# EAGLE design Yaesu to CIV_FET (EAGLE 9.6.2)
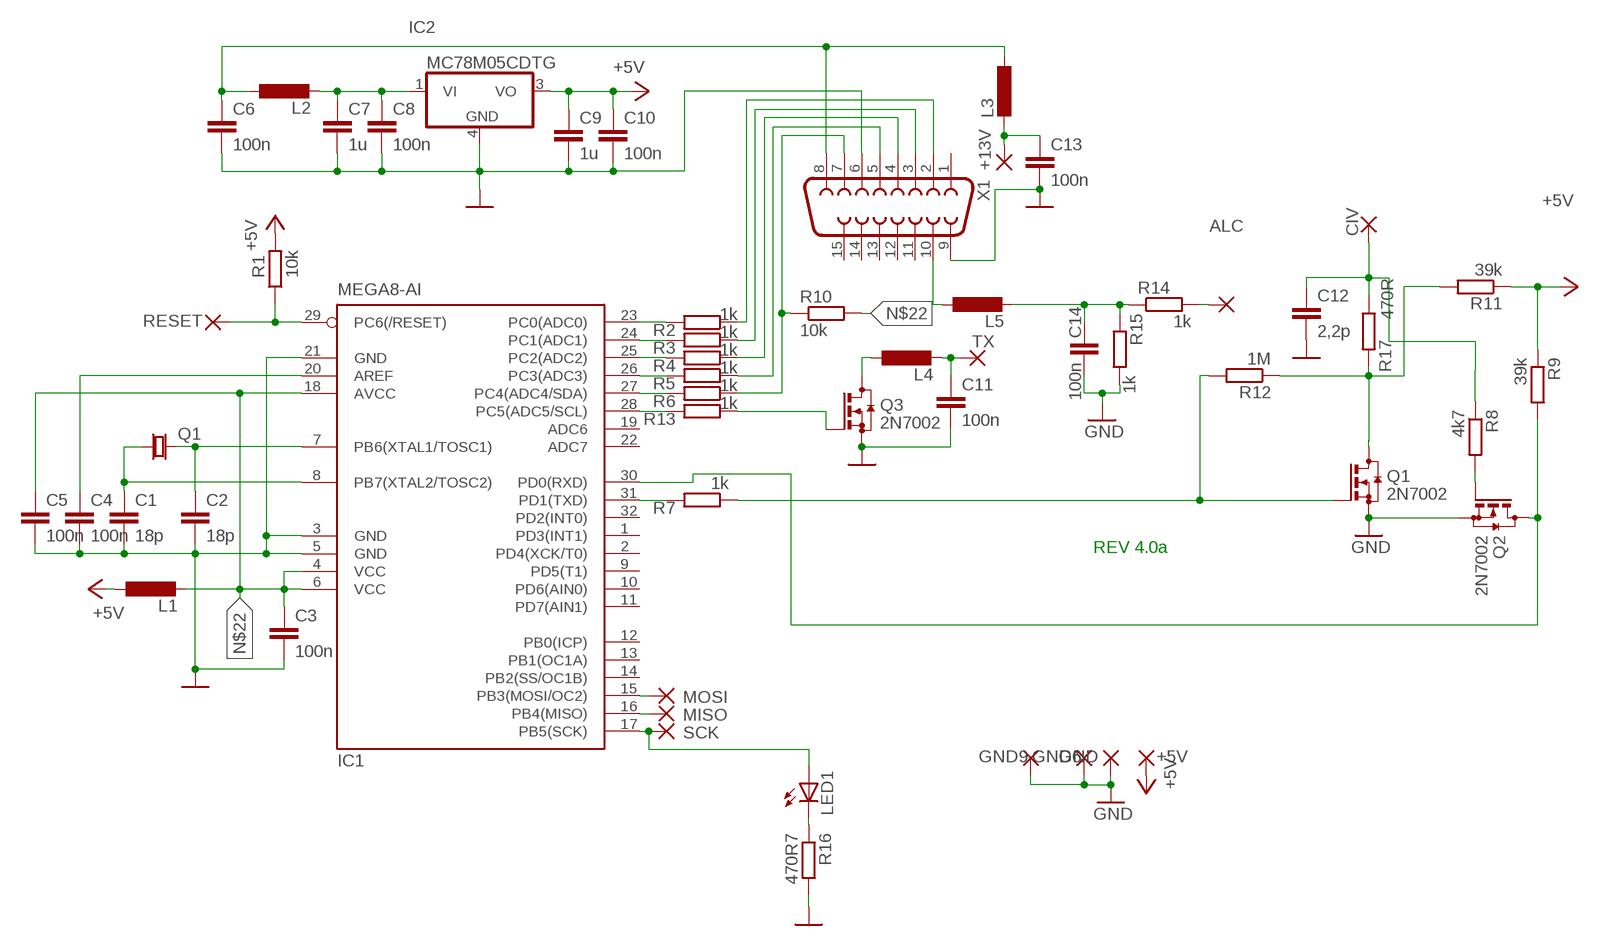
[diagram p0: schematic, sheet 1]

## Parts
+5V  SMD2  [SMD1,27-2,54]
+13V  SMD2  [SMD1,27-2,54]
ALC  SMD2  [SMD1,27-2,54]
C1  18p  C-EUC0603K  [C0603K]
C2  18p  C-EUC0603K  [C0603K]
C3  100n  C-EUC0603K  [C0603K]
C4  100n  C-EUC0603K  [C0603K]
C5  100n  C-EUC0603K  [C0603K]
C6  100n  C-EUC0603K  [C0603K]
C7  1u  C-EUC0805K  [C0805K]
C8  100n  C-EUC0603K  [C0603K]
C9  1u  C-EUC0805K  [C0805K]
C10  100n  C-EUC0603K  [C0603K]
C11  100n  C-EUC0603K  [C0603K]
C12  2,2p  C-EUC0603K  [C0603K]
C13  100n  C-EUC0603K  [C0603K]
C14  100n  C-EUC0603K  [C0603K]
CIV  SMD2  [SMD1,27-2,54]
GND  SMD2  [SMD1,27-2,54]
GND6  SMD2  [SMD1,27-2,54]
GND9  SMD2  [SMD1,27-2,54]
IC1  MEGA8-AI  [TQFP32-08]
IC2  MC78M05CDTG  [DPACK_3]
L1  L-EUL2012C  [L2012C]
L2  L-EUL1812  [L1812]
L3  L-EUL1812  [L1812]
L4  L-EUL2012C  [L2012C]
L5  L-EUL2012C  [L2012C]
LED1  LEDCHIP-LED0603  [CHIP-LED0603]
MISO  SMD2  [SMD1,27-2,54]
MOSI  SMD2  [SMD1,27-2,54]
Q1  2N7002  BSS123  [SOT23]
Q2  2N7002  BSS123  [SOT23]
Q3  2N7002  BSS123  [SOT23]
R1  10k  R-EU_R0603  [R0603]
R2  1k  R-EU_R0603  [R0603]
R3  1k  R-EU_R0603  [R0603]
R4  1k  R-EU_R0603  [R0603]
R5  1k  R-EU_R0603  [R0603]
R6  1k  R-EU_R0603  [R0603]
R7  1k  R-EU_R0603  [R0603]
R8  4k7  R-EU_R0603  [R0603]
R9  39k  R-EU_R0603  [R0603]
R10  10k  R-EU_R0603  [R0603]
R11  39k  R-EU_R0603  [R0603]
R12  1M  R-EU_R0603  [R0603]
R13  1k  R-EU_R0603  [R0603]
R14  1k  R-EU_R0603  [R0603]
R15  1k  R-EU_R0603  [R0603]
R16  470R7  R-EU_R0603  [R0603]
R17  470R  R-EU_R0603  [R0603]
RESET  SMD2  [SMD1,27-2,54]
SCK  SMD2  [SMD1,27-2,54]
TX  SMD2  [SMD1,27-2,54]
X1  F15D  [F15D]

## Nets
+5V: +5V.1(P) C9.1 C10.1 IC2.3(VO) L1.1 R1.2 R9.1 R11.1
+13V: C6.1 L2.1 L3.1 X1.8
GND: C1.2 C2.2 C3.2 C4.2 C5.2 C6.2 C7.2 C8.2 C9.2 C10.2 C11.2 C12.2 C13.2 C14.2 GND6.1(P) GND9.1(P) GND.1(P) IC1.3(GND) IC1.5(GND) IC1.21(GND) IC2.4(GND) Q1.2(S) Q2.2(S) Q3.2(S) R15.2 R16.2 X1.6 X1.9
N$1: C2.1 IC1.7(PB6(XTAL1/TOSC1))
N$2: C1.1 IC1.8(PB7(XTAL2/TOSC2))
N$3: IC1.29(PC6(/RESET)) R1.1 RESET.1(P)
N$4: Q1.3(D)
N$5: IC1.23(PC0(ADC0)) R2.2
N$7: IC1.31(PD1(TXD)) R7.2
N$8: C4.1 IC1.20(AREF)
N$9: IC1.24(PC1(ADC1)) R3.2
N$10: IC1.25(PC2(ADC2)) R4.2
N$11: IC1.26(PC3(ADC3)) R5.2
N$12: R2.1 X1.2
N$13: R3.1 X1.3
N$14: R4.1 X1.4
N$15: R5.1 X1.5
N$16: IC1.27(PC4(ADC4/SDA)) R6.2
N$17: Q1.1(G) R7.1 R12.2
N$18: +13V.1(P) C13.1 L3.2
N$19: C7.1 C8.1 IC2.1(VI) L2.2
N$20: R11.2 R12.1 R17.2
N$21: L5.1 X1.10
N$22: C3.1 C5.1 IC1.4(VCC) IC1.6(VCC) IC1.18(AVCC) L1.2 R10.2
N$23: IC1.28(PC5(ADC5/SCL)) R13.2
N$24: IC1.17(PB5(SCK)) LED1.A SCK.1(P)
N$25: IC1.16(PB4(MISO)) MISO.1(P)
N$27: Q3.1(G) R13.1
N$28: L4.1 Q3.3(D)
N$29: ALC.1(P) R14.2
N$30: IC1.15(PB3(MOSI/OC2)) MOSI.1(P)
N$31: Q2.1(G) R8.2
N$33: IC1.30(PD0(RXD)) Q2.3(D) R9.2
N$34: C14.1 L5.2 R14.1 R15.1
N$35: C12.1 CIV.1(P) R8.1 R17.1
N$36: LED1.C R16.1
TX_IN: R6.1 R10.1 X1.7
TX_OUT: C11.1 L4.2 TX.1(P)
Unconnected: IC1.1(PD3(INT1)) IC1.2(PD4(XCK/T0)) IC1.9(PD5(T1)) IC1.10(PD6(AIN0)) IC1.11(PD7(AIN1)) IC1.12(PB0(ICP)) IC1.13(PB1(OC1A)) IC1.14(PB2(SS/OC1B)) IC1.19(ADC6) IC1.22(ADC7) IC1.32(PD2(INT0)) X1.1 X1.11 X1.12 X1.13 X1.14 X1.15

## Notes on the sheet
- Q1
- REV 4.0a

## Library data of the parts
+5V +13V ALC CIV GND GND6 GND9 MISO MOSI RESET SCK TX = wirepad:SMD2: SMD PAD
C1-C14 = rcl:C-EU: CAPACITOR, European symbol; SPICEPREFIX: C
IC1 = atmel:MEGA8: MICROCONTROLLER 8 Kbytes FLASH, 1 kbytes SRAM, 512 bytes EEPROM, USART, 6-channel 10 bit ADC, 2-channel 8 bit ADC Pin compatible with Atmega48, ATMega88, ATMega168 Source: avr.lbr; MPN: ATMEGA8-16AU; OC_FARNELL: 9171371; OC_NEWARK: 73M8863
IC2 = linear:MC78M: 500 mA Positive Voltage Regulators Source: Data sheet <http://www.onsemi.com/pub_link/Collateral/MC78M00-D.PDF>
L1-L5 = rcl:L-EU: INDUCTOR, European symbol; SPICEPREFIX: L
LED1 = led:LED: LED OSRAM: - CHIPLED LG R971, LG N971, LY N971, LG Q971, LY Q971, LO R971, LY R971 LH N974, LH R974 LS Q976, LO Q976, LY Q976 LO Q996 - Hyper CHIPLED LW Q18S LB Q993, LB Q99A, LB R99A - SideLED LS A670, LO A670, LY A670, LG A670, LP A670 LB A673, LV A673, LT A673, LW A673 LH A674 LY A675 LS A676, LA A676, LO A676, LY A676, LW A676 LS A679, LY A679, LG A679 - Hyper Micro SIDELED® LS Y876, LA Y876, LO Y876, LY Y876 LT Y87S - SmartLED LW L88C, LW L88S LB L89C, LB L89S, LG L890 LS L89K, LO L89K, LY L89K LS L896, LA L896, LO L896, LY L896 - TOPLED LS T670, LO T670, LY T670, LG T670, LP T670 LSG T670, LSP T670, LSY T670, LOP T670, LYG T670 LG T671, LOG T671, LSG T671 LB T673, LV T673, LT T673, LW T673 LH T674 LS T676, LA T676, LO T676, LY T676, LB T676, LH T676, LSB T676, LW T676 LB T67C, LV T67C, LT T67C, LS T67K, LO T67K, LY T67K, LW E67C LS E67B, LA E67B, LO E67B, LY E67B, LB E67C, LV E67C, LT E67C LW T67C LS T679, LY T679, LG T679 LS T770, LO T770, LY T770, LG T770, LP T770 LB T773, LV T773, LT T773, LW T773 LH T774 LS E675, LA E675, LY E675, LS T675 LS T776, LA T776, LO T776, LY T776, LB T776 LHGB T686 LT T68C, LB T68C - Hyper Mini TOPLED® LB M676 - Mini TOPLED Santana® LG M470 LS M47K, LO M47K, LY M47K Source: http://www.osram.convergy.de LUXEON: - LUMILED® LXK2-PW12-R00, LXK2-PW12-S00, LXK2-PW14-U00, LXK2-PW14-V00 LXK2-PM12-R00, LXK2-PM12-S00, LXK2-PM14-U00 LXK2-PE12-Q00, LXK2-PE12-R00, LXK2-PE12-S00, LXK2-PE14-T00, LXK2-PE14-U00 LXK2-PB12-K00, LXK2-PB12-L00, LXK2-PB12-M00, LXK2-PB14-N00, LXK2-PB14-P00, LXK2-PB14-Q00 LXK2-PR12-L00, LXK2-PR12-M00, LXK2-PR14-Q00, LXK2-PR14-R00 LXK2-PD12-Q00, LXK2-PD12-R00, LXK2-PD12-S00 LXK2-PH12-R00, LXK2-PH12-S00 LXK2-PL12-P00, LXK2-PL12-Q00, LXK2-PL12-R00 Source: www.luxeon.com KINGBRIGHT: KA-3528ASYC Source: www.kingbright.com
Q1-Q3 = transistor-small-signal:BSS123: N-CHANNEL MOS FET
R1-R17 = rcl:R-EU_: RESISTOR, European symbol; SPICEPREFIX: R
X1 = con-subd:F15: SUB-D; OC_FARNELL: unknown; OC_NEWARK: unknown

## Board
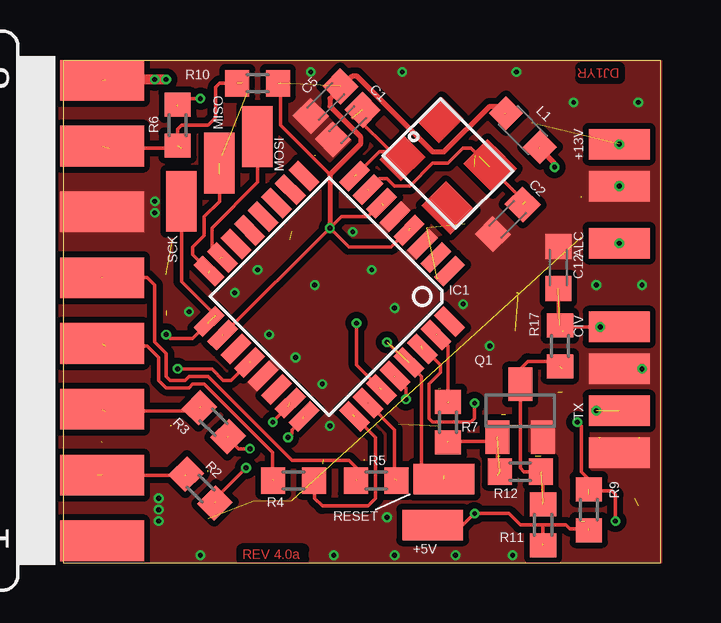
[diagram p1: board, top side]
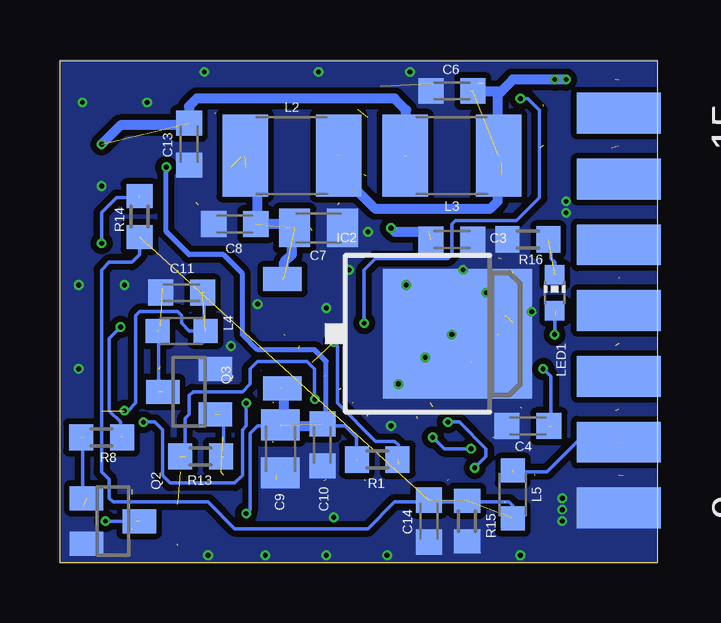
[diagram p2: board, bottom side, seen from below]

Size 24.91 x 20.95 mm. Coordinates in mm from the lower left corner, seen from the top.
Outline: 0,0 24.91,0 24.91,20.95 0,20.95 0,0
Copper layers (1*16): Top 0.035mm / dielectric 1.5mm / Bottom 0.035mm
Design rules "default *": minimum track width 6mil, minimum drill 0.35mm, track to track 6mil, track to pad 6mil, pad to pad 6mil, via to via 6mil, smd to smd 6mil, copper to edge 0mil, drill to drill 6mil, minimum pad ring 5mil, minimum via ring 4mil, stop-mask expansion 4mil, vias tented up to drill 0mil, thermal gap 10mil

### Footprints (pad centres in the part's own frame; a part is rotated, then mirrored left to right if it is on the bottom)
SMD1,27-2,54 = smd 1.27 x 2.54: 1 0,0
C0603K = smd 1.05 x 1.08: 1 -0.875,0; 2 0.875,0
C0805K = smd 1.3 x 1.6: 1 -1,0; 2 1,0
TQFP32-08 = smd 1.27 x 0.559: 1 -4.293,2.8; 2 -4.293,2; 3 -4.293,1.2; 4 -4.293,0.4; 5 -4.293,-0.4; 6 -4.293,-1.2; 7 -4.293,-2; 8 -4.293,-2.8; 17 4.293,-2.8; 18 4.293,-2; 19 4.293,-1.2; 20 4.293,-0.4; 21 4.293,0.4; 22 4.293,1.2; 23 4.293,2; 24 4.293,2.8 | smd 0.559 x 1.27: 9 -2.8,-4.293; 10 -2,-4.293; 11 -1.2,-4.293; 12 -0.4,-4.293; 13 0.4,-4.293; 14 1.2,-4.293; 15 2,-4.293; 16 2.8,-4.293; 25 2.8,4.293; 26 2,4.293; 27 1.2,4.293; 28 0.4,4.293; 29 -0.4,4.293; 30 -1.2,4.293; 31 -2,4.293; 32 -2.8,4.293
DPACK_3 = smd 1 x 1.6: 1 -2.28,-4.8; 3 2.28,-4.8 | smd 5.4 x 6.2: 4 0,2.5
L2012C = smd 1 x 1: 1 -1,0; 2 1,0
L1812 = smd 1.9 x 3.4: 1 -1.95,0; 2 1.95,0
CHIP-LED0603 = smd 0.8 x 0.8: A 0,-0.75; C 0,0.75
SOT23 = smd 1 x 1.4: 1 -0.95,-1.1; 2 0.95,-1.1; 3 0,1.1
R0603 = smd 1 x 1.1: 1 -0.85,0; 2 0.85,0
F15D = smd 1.7 x 3.5: 1 -9.601,-6.045; 2 -6.858,-6.045; 3 -4.115,-6.045; 4 -1.372,-6.045; 5 1.372,-6.045; 6 4.115,-6.045; 7 6.858,-6.045; 8 9.601,-6.045 | smd 1.7 x 3.5 bottom: 9 -8.23,-6.045; 10 -5.486,-6.045; 11 -2.743,-6.045; 12 0,-6.045; 13 2.743,-6.045; 14 5.486,-6.045; 15 8.23,-6.045

### Placement (x,y rotation side)
+5V  15.4,1.59 90 top
+13V  23.18,17.46 90 top
ALC  23.18,13.34 90 top
C1  11.86,18.28 225 top
C2  18.53,14.33 225 top
C3  8.57,13.49 0 bottom
C4  5.4,5.71 180 bottom
C5  10.93,19.26 225 top
C6  8.57,19.68 180 bottom
C7  14.13,13.97 0 bottom
C8  17.62,14.13 180 bottom
C9  15.72,4.76 270 bottom
C10  13.97,4.92 270 bottom
C11  19.84,11.27 180 bottom
C12  20.64,12.32 90 top
C13  19.53,17.46 270 bottom
C14  9.53,1.75 270 bottom
CIV  23.18,9.84 90 top
GND  23.18,8.1 90 top
GND6  23.18,4.6 90 top
GND9  23.18,15.72 90 top
IC1  11.08,11.12 225 top
IC2  10.84,9.56 270 bottom
L1  19.16,18.05 135 top
L2  15.24,16.99 180 bottom
L3  8.57,16.99 180 bottom
L4  19.84,9.68 0 bottom
L5  6.03,2.86 270 bottom
LED1  4.29,11.27 0 bottom
MISO  6.51,16.67 0 top
MOSI  8.1,17.78 0 top
Q1  19.05,6.35 0 top
Q2  22.7,1.75 270 bottom
Q3  19.53,7.14 90 bottom
R1  11.69,4.32 180 bottom
R2  5.72,3.1 315 top
R3  6.27,5.87 315 top
R4  9.6,3.44 0 top
R5  13.05,3.44 0 top
R6  4.76,18.26 90 top
R7  16.03,5.87 90 top
R8  23.18,5.24 180 bottom
R9  21.91,2.22 90 top
R10  8.1,20 0 top
R11  20,1.59 90 top
R12  19.05,3.81 180 top
R13  19.05,4.45 180 bottom
R14  21.59,14.45 90 bottom
R15  7.94,1.75 270 bottom
R16  5.4,13.49 180 bottom
R17  20.7,9.05 270 top
RESET  15.88,3.49 90 top
SCK  4.92,15.08 0 top
TX  23.18,6.35 90 top
X1  -4.44,10.53 90 top

### Tracks (layer width: path | path; a pad name or v marks a point on that pad's centre or on a via)
+5V  (via drill 0.2)  (7 unrouted)
  Top 0.15: v17.14,2.06 18.57,2.06 19.05,1.59 20,1.59 | 20,1.59 20.95,1.59 21.11,1.43 21.91,1.43 | 20,0.79 20,1.59
  Top 0.152: v17.14,2.06 16.67,1.59 +5V.1
  Top 0.203: v20.48,16.51 20.48,16.67 19.84,17.3
  Bottom 0.152: 13.97,5.71 13.02,5.71 12.54,5.24 12.54,4.29 | 15.56,5.71 16.67,5.71 16.99,5.4 16.99,2.22 v17.14,2.06
  Bottom 0.203: 15.72,5.71 15.56,5.71 | 15.56,7.3 15.72,7.3 | 13.97,5.71 13.97,5.87 13.81,5.87 13.81,8.41 14.29,8.89 16.67,8.89 17.3,9.53 17.3,12.06 18.1,12.86 19.53,12.86 20.48,13.81 v20.48,16.51
  Bottom 0.406: 15.56,7.3 15.56,5.71 13.97,5.71
+13V  (via drill 0.2)  (4 unrouted)
  Top 0.406: v4.29,20.16 1.75,20.16
  Bottom 0.406: v3.81,20.16 v4.29,20.16 6.03,20.16 6.51,19.68 | 6.51,19.68 6.67,19.53 6.67,15.08 6.99,14.76 11.75,14.76 13.34,16.35 13.34,16.99 | 7.78,19.68 6.51,19.68
GND  (via drill 0.2)
  other vias: 3.81,14.61 9.68,8.57 3.81,15.08 12.06,13.81 12.86,12.22 16.67,10.79 3.97,2.7 3.97,2.22 3.97,1.75 24.13,8.1 10.32,20.48 14.13,20.48 5.71,0.32 11.27,0.32 16.35,0.32 13.81,0.32 18.73,0.32 11.11,5.71 10.79,7.46 13.81,10.64 10.48,11.59 8.57,9.53 7.14,11.27 8.1,12.22 23.18,15.72 23.97,19.21 18.89,20.48 21.27,19.21 5.24,10.48 13.49,1.91 17.78,9.05 22.23,11.59 24.13,11.59
  pour Bottom (isolate 0.254, no thermals): 0,20.95 24.92,20.95 24.92,0 0,0
  pour Top (isolate 0.254, no thermals): -0.16,20.95 24.92,20.95 24.92,0 -0.16,0
N$1  (3 unrouted)
  Top 0.152: 17.34,16.95 19.25,15.04 | 12.7,15.56 13.18,16.03 13.49,16.03 13.81,15.72 14.45,15.72 15.4,16.67 16.03,16.67 16.67,17.3 16.99,17.3 17.78,16.51
N$2  (2 unrouted)
  Top 0.152: 12.22,16.19 13.18,17.14 13.65,17.14 | 13.65,17.14 13.81,17.14 | 13.65,17.14 12.22,18.57 12.06,18.57
N$3  (via drill 0.2)  (3 unrouted)
  Top 0.152: 15.88,3.65 14.92,3.65 14.92,7.78 v13.49,9.21
  Bottom 0.152: v13.49,9.21 13.34,9.05 13.34,6.67 11.75,5.08 10.95,5.08 10.79,4.92 10.79,4.13
N$5  (via drill 0.2)  (2 unrouted)
  Top 0.152: v8.73,5.87 9.37,6.51 | v7.62,3.97 6.35,2.7 6.35,2.54
  Bottom 0.152: v8.73,5.87 8.26,5.87 7.14,4.76 7.14,4.45 v7.62,3.97
N$6
  Bottom 0.152: 21.59,13.65 21.59,12.86 21.91,12.54 22.86,12.54 23.18,12.22 23.18,3.81 22.86,3.49 22.86,2.7 22.7,2.54 18.73,2.54 17.62,1.43 12.06,1.43 10.95,2.54 6.19,2.54 6.03,2.38 6.03,1.91
N$7  (2 unrouted)
  Top 0.152: 16.03,6.67 16.03,9.05 15.56,9.53
N$8  (via drill 0.2)  (2 unrouted)
  Top 0.152: 7.78,8.41 6.99,7.62 6.67,7.62 6.19,8.1 v4.76,8.1
  Bottom 0.152: v4.76,8.1 4.45,7.78 4.45,5.71
N$9  (via drill 0.2)  (2 unrouted)
  Top 0.152: v9.37,5.24 9.53,5.4 9.53,5.56 10,6.03 | v7.78,4.76 7.3,4.76 6.83,5.24
  Bottom 0.152: v9.37,5.24 8.89,4.76 v7.78,4.76
N$10  (2 unrouted)
  Top 0.152: 12.06,6.19 13.02,5.24 13.02,2.7 12.7,2.38 10.79,2.38 10.48,2.7 10.48,3.49
N$11  (2 unrouted)
  Top 0.152: IC1.26 13.81,5.56 13.81,3.49
N$12  (2 unrouted)
  Top 0.152: 5.08,3.65 1.43,3.65
N$13  (2 unrouted)
  Top 0.152: 5.71,6.51 5.56,6.35 1.75,6.35
N$14  (2 unrouted)
  Top 0.152: 1.75,9.05 3.49,9.05 3.97,8.57 3.97,7.62 4.29,7.3 5.24,7.3 5.4,7.46 5.87,7.46 8.73,4.6 8.73,3.49
N$15  (2 unrouted)
  Top 0.152: 1.59,11.91 3.49,11.91 3.81,11.59 3.81,9.21 4.29,8.73 4.29,7.78 4.45,7.62 5.08,7.62 5.24,7.78 6.03,7.78 9.53,4.29 11.91,4.29 12.22,3.97 12.22,3.49
N$16  (via drill 0.2)  (2 unrouted)
  Top 0.152: 13.18,7.3 12.22,8.26 v12.22,10 | v5.71,19.37 4.76,19.37 4.76,19.05
  Bottom 0.152: v12.22,10 12.22,12.22 11.75,12.7 8.73,12.7 8.57,12.86 8.57,14.13 8.41,14.29 5.87,14.29 4.92,15.24 4.92,18.89 5.4,19.37 v5.71,19.37
N$17  (3 unrouted)
  Top 0.152: 18.1,3.65 18.1,5.08 16.03,5.08
N$18  (via drill 0.2)  (2 unrouted)
  Bottom 0.406: 10.48,16.99 10.48,18.89 10.95,19.37 19.21,19.37 19.53,19.05 19.53,18.26 22.38,18.26 +13V.1
  other vias: 23.18,17.46
N$19  (4 unrouted)
  Bottom 0.406: 15.56,11.91 15.56,12.54 15.24,12.86 15.24,14.13 16.67,14.13 16.67,16.35 16.83,16.51 17.14,16.51
N$20  (3 unrouted)
  Top 0.15: 20,2.54 20,3.65 19.84,3.81 19.21,3.81 19.05,3.97 19.05,8.1 19.37,8.41 20.8,8.41 20.8,8.1
N$21  (2 unrouted)
  Bottom 0.152: 1.59,5.08 3.33,5.08 4.6,3.81 6.03,3.81
N$22  (via drill 0.2)  (7 unrouted)
  Top 0.152: 6.67,9.53 v11.11,13.97 | 14.45,13.97 13.65,13.18 11.91,13.18 v11.11,13.97 | v11.11,13.97 11.59,14.45 12.7,14.45 13.18,14.92 13.34,14.92 | 11.11,16.19 9.05,18.26 9.05,20
  Top 0.2: 11.27,19.53 11.11,19.37 11.11,19.05 12.38,17.78 12.38,17.46 11.11,16.19 v11.11,13.97
  Top 0.203: 11.27,19.53 12.06,20.32 12.22,20.32 15.4,17.14 15.88,17.14 17.78,19.05 18.1,19.05 18.41,18.73
  Bottom 0.406: v11.11,13.97 10.95,13.81 9.53,13.81
N$23  (via drill 0.2)  (2 unrouted)
  Top 0.152: v14.29,6.83 14.29,7.3 13.81,7.78
  Bottom 0.152: v14.29,6.83 14.29,8.1 14.61,8.41 16.67,8.41 16.99,8.1 16.99,7.46 17.3,7.14 19.37,7.14 19.53,6.99 19.53,6.19 19.68,6.03 19.68,4.45
N$24  (via drill 0.2)  (3 unrouted)
  Top 0.152: 6.35,10.32 4.92,11.75 SCK.1 | 6.03,10 5.4,9.37 4.45,9.37 v4.29,9.53
  Bottom 0.152: v4.29,9.53 4.29,10.32
N$25  (2 unrouted)
  Top 0.152: 6.03,12.06 6.03,12.22 5.4,12.86 5.4,13.18 5.87,13.65 5.87,14.45 6.51,15.08 6.51,16.19
N$27  (2 unrouted)
  Bottom 0.152: 18.1,4.45 18.1,6.19 18.26,6.19
N$28  (2 unrouted)
  Bottom 0.152: 20.8,7.14 20.8,9.68
N$29  (via drill 0.2)  (1 unrouted)
  Bottom 0.152: ALC.1 23.18,14.61 22.54,15.24 21.59,15.24
  other vias: 23.18,13.34
N$30  (1 unrouted)
  Top 0.152: 6.51,12.7 6.51,12.86 6.19,13.18 6.19,13.97 8.1,15.88 MOSI.1
N$31  (2 unrouted)
  Bottom 0.152: 23.97,2.38 23.97,5.24
N$33  (via drill 0.2)  (3 unrouted)
  Top 0.152: v21.43,5.87 21.59,5.71 21.59,3.81 21.91,3.49 21.91,3.02 | 21.91,3.02 21.91,2.86 | v17.14,6.67 17.14,6.03 16.99,5.87 15.4,5.87 15.24,6.03 15.24,7.46 15.72,7.94 15.72,8.26 14.92,9.05 | v23.02,1.75 23.02,2.86 22.86,3.02 21.91,3.02
  Bottom 0.152: v17.14,6.67 17.14,5.71 17.3,5.56 17.3,3.65 17.62,3.33 20.32,3.33 20.64,3.65 20.64,5.56 20.95,5.87 v21.43,5.87 | v23.02,1.75 21.75,1.75
N$34  (3 unrouted)
N$35  (via drill 0.2)  (3 unrouted)
  Top 0.15: CIV.1 v22.38,9.84 20.64,9.84 C12.1
  Bottom 0.15: v22.38,9.84 22.86,9.37 22.86,6.35 22.38,5.87 22.38,5.4 22.54,5.24 22.38,5.24
N$36  (1 unrouted)
N$37
  Bottom 0.152: 4.29,12.06 4.29,12.54 4.45,12.7 4.45,13.49
TX_IN  (3 unrouted)
  Top 0.152: 1.91,17.3 4.76,17.3 | 4.76,17.3 4.92,17.3 | 4.76,17.3 4.76,18.1 4.92,18.26 6.03,18.26 6.35,18.57 6.35,19.84 6.51,20 7.46,20
TX_OUT  (via drill 0.2)  (3 unrouted)
  Bottom 0.152: 18.89,11.27 18.89,9.68 19.53,9.68 19.84,10 19.84,10.32 20,10.48 21.59,10.48 21.75,10.32 21.75,6.67 22.07,6.35 v22.23,6.35
(copper drawn outside any net)
  shapes: Top area x6

### Text on the board
Top: DJ1YR | REV 4.0a